# Altium schematic sheet Power_MPU.SchDoc: Power_MPU
size A3; CompanyName: STMicroelectronics; DocumentNumber: MB1272; Revision: A-01; SheetNumber: 4; SheetTotal: 15; Project: STM32MP15-DISCO PI
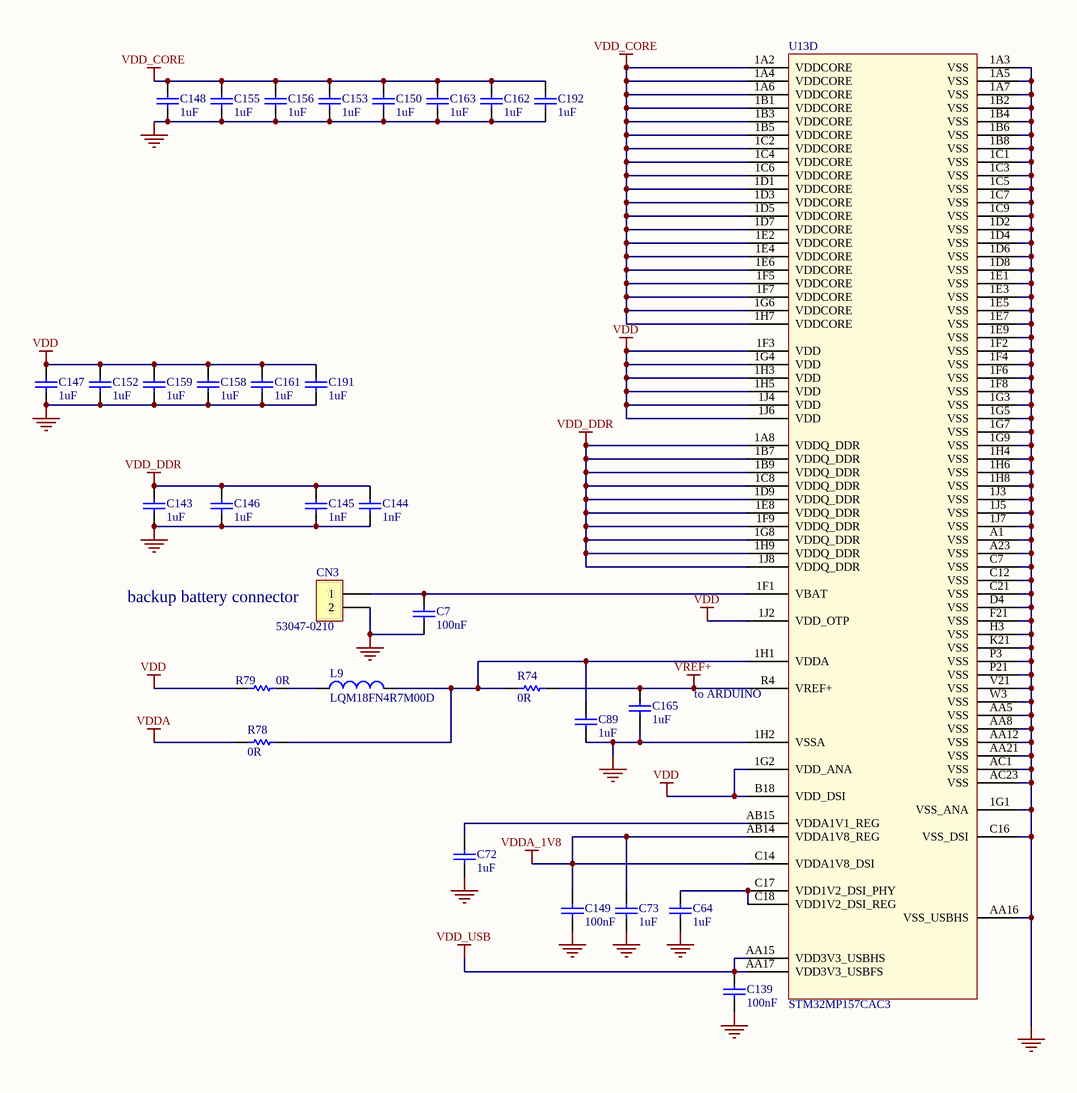
[diagram p0: Power_MPU.SchDoc]

## Parts
C7  value 100nF  [C0402]
C64  value 1uF  [C0402]
C72  value 1uF  [C0402]
C73  value 1uF  [C0402]
C89  value 1uF  [C0402]
C139  value 100nF  [C0402]
C143  value 1uF  [C0402]
C144  value 1nF  [C0402]
C145  value 1nF  [C0402]
C146  value 1uF  [C0402]
C147  value 1uF  [C0402]
C148  value 1uF  [C0402]
C149  value 100nF  [C0402]
C150  value 1uF  [C0402]
C152  value 1uF  [C0402]
C153  value 1uF  [C0402]
C155  value 1uF  [C0402]
C156  value 1uF  [C0402]
C158  value 1uF  [C0402]
C159  value 1uF  [C0402]
C161  value 1uF  [C0402]
C162  value 1uF  [C0402]
C163  value 1uF  [C0402]
C165  value 1uF  [C0402]
C191  value 1uF  [C0402]
C192  value 1uF  [C0402]
CN3  value 53047-0210  [CON_MOLEX_53047-0210]
L9  LQM18FN4R7M00D  [L0603]
R74  value 0R  [R0402]
R78  value 0R  [R0402]
R79  value 0R  [R0402]
U13  STM32MP157CAC3  [ICC_TFBGA361_12X12_STM32MP157CAC3_P050-065]  (part D of 5)

## Nets
GND: C7.1 C64.1 C72.1 C73.1 C89.1 C139.1 C143.1 C144.1 C145.1 C146.1 C147.1 C148.1 C149.1 C150.1 C152.1 C153.1 C155.1 C156.1 C158.1 C159.1 C161.1 C162.1 C163.1 C165.1 C191.1 C192.1 CN3.2 U13.1A3(VSS) U13.1A5(VSS) U13.1A7(VSS) U13.1B2(VSS) U13.1B4(VSS) U13.1B6(VSS) U13.1B8(VSS) U13.1C1(VSS) U13.1C3(VSS) U13.1C5(VSS) U13.1C7(VSS) U13.1C9(VSS) U13.1D2(VSS) U13.1D4(VSS) U13.1D6(VSS) U13.1D8(VSS) U13.1E1(VSS) U13.1E3(VSS) U13.1E5(VSS) U13.1E7(VSS) U13.1E9(VSS) U13.1F2(VSS) U13.1F4(VSS) U13.1F6(VSS) U13.1F8(VSS) U13.1G1(VSS_ANA) U13.1G3(VSS) U13.1G5(VSS) U13.1G7(VSS) U13.1G9(VSS) U13.1H2(VSSA) U13.1H4(VSS) U13.1H6(VSS) U13.1H8(VSS) U13.1J3(VSS) U13.1J5(VSS) U13.1J7(VSS) U13.A1(VSS) U13.A23(VSS) U13.AA5(VSS) U13.AA8(VSS) U13.AA12(VSS) U13.AA16(VSS_USBHS) U13.AA21(VSS) U13.AC1(VSS) U13.AC23(VSS) U13.C7(VSS) U13.C12(VSS) U13.C16(VSS_DSI) U13.C21(VSS) U13.D4(VSS) U13.F21(VSS) U13.H3(VSS) U13.K21(VSS) U13.P3(VSS) U13.P21(VSS) U13.V21(VSS) U13.W3(VSS)
VDD: C147.2 C152.2 C158.2 C159.2 C161.2 C191.2 R79.1 U13.1F3(VDD) U13.1G2(VDD_ANA) U13.1G4(VDD) U13.1H3(VDD) U13.1H5(VDD) U13.1J2(VDD_OTP) U13.1J4(VDD) U13.1J6(VDD) U13.B18(VDD_DSI)
VDD_CORE: C148.2 C150.2 C153.2 C155.2 C156.2 C162.2 C163.2 C192.2 U13.1A2(VDDCORE) U13.1A4(VDDCORE) U13.1A6(VDDCORE) U13.1B1(VDDCORE) U13.1B3(VDDCORE) U13.1B5(VDDCORE) U13.1C2(VDDCORE) U13.1C4(VDDCORE) U13.1C6(VDDCORE) U13.1D1(VDDCORE) U13.1D3(VDDCORE) U13.1D5(VDDCORE) U13.1D7(VDDCORE) U13.1E2(VDDCORE) U13.1E4(VDDCORE) U13.1E6(VDDCORE) U13.1F5(VDDCORE) U13.1F7(VDDCORE) U13.1G6(VDDCORE) U13.1H7(VDDCORE)
VDD_DDR: C143.2 C144.2 C145.2 C146.2 U13.1A8(VDDQ_DDR) U13.1B7(VDDQ_DDR) U13.1B9(VDDQ_DDR) U13.1C8(VDDQ_DDR) U13.1D9(VDDQ_DDR) U13.1E8(VDDQ_DDR) U13.1F9(VDDQ_DDR) U13.1G8(VDDQ_DDR) U13.1H9(VDDQ_DDR) U13.1J8(VDDQ_DDR)
VDD_USB: C139.2 U13.AA15(VDD3V3_USBHS) U13.AA17(VDD3V3_USBFS)
VDDA: R78.1
VDDA_1V8: C73.2 C149.2 U13.AB14(VDDA1V8_REG) U13.C14(VDDA1V8_DSI)
VREF+: C165.2 R74.2 U13.R4(VREF+)
NetC7_2: C7.2 CN3.1 U13.1F1(VBAT)
NetC64_2: C64.2 U13.C17(VDD1V2_DSI_PHY) U13.C18(VDD1V2_DSI_REG)
NetC72_2: C72.2 U13.AB15(VDDA1V1_REG)
NetC89_2: C89.2 L9.2 R74.1 R78.2 U13.1H1(VDDA)
NetL9_1: L9.1 R79.2

## Notes on the sheet
- (near CN3) backup battery connector
- to ARDUINO
- Title:
- Project:
- Size:
- Revision:
- Variant:
- A3
- -
- Date:
- Reference:
- Sheet:
- of

## Library data of the parts
C7 C139 C149 = MCD-00006: Capacitor,100nF,16V,X7R,10%,0402; Manufacturer_Part_Number: CC0402KRX7R7BB104; Manufacturer: YAGEO; Alternate_Manufacturer: MURATA; Alternate_Manufacturer_Part_Number: GCM155R71C104KA55D; Provided_By: SUBCO; Initial_Board_Reference: MB1274; Internal_Part_Number: MCD-00006; ComponentLink1Description: Datasheet; ECCN_US: n/a; ECCN_EU: n/a; Status: Released; Part_Type: Capacitor; Package: C0402; ComponentLink1URL: http://tunmcdsvn.tun.st.com/Component_Datasheet_Library/Trunk/Capacitors/Yageo_Multilayer_Capacitor_X7R_series_100pF_to_22uF
C64 C72 C73 C89 C143 C146-C148 C150 C152 C153 C155 C156 C158 C159 C161-C163 C165 C191 C192 = MCD-00095: Capacitor,1uF,6V3,X5R,10%,0402; Manufacturer_Part_Number: GRM155R61E105KA12; Manufacturer: MURATA; Alternate_Manufacturer_Part_Number: GRM155R60J105KE19; ECCN_US: EAR99; ECCN_EU: NEC; Provided_By: SUBCO; Initial_Board_Reference: MB1262; Internal_Part_Number: MCD-00095; Status: Released; Part_Type: Capacitor; Package: C0402; ComponentLink1Description: Datasheet; ComponentLink1URL: http://tunmcdsvn.tun.st.com/Component_Datasheet_Library/Trunk/Capacitors/Murata_Capacitor_GR_series; Alternate_Manufacturer: MURATA
C144 C145 = MCD-00198: Capacitor,1nF,16V,X7R,10%,0402; Manufacturer_Part_Number: CC0402KRX7R7BB102; Manufacturer: YAGEO; Provided_By: SUBCO; Internal_Part_Number: MCD-00198; Status: Released; Part_Type: Capacitor; Package: C0402; ComponentLink1Description: Datasheet; ComponentLink1URL: http://tunmcdsvn.tun.st.com/Component_Datasheet_Library/Trunk/Capacitors/Yageo_Multilayer_Capacitor_X7R_series_100pF_to_22uF
CN3 = MCD-00655: Header 2 circuits, 1.25mm Pitch ,  Vertical, with Friction Lock; Part_Type: Connector; Manufacturer: MOLEX; Provided_By: SUBCO; Initial_Board_Reference: MB1272; Internal_Part_Number: MCD-00655; Status: Footprint available; Manufacturer_Part_Number: 53047-0210; ComponentLink1Description: Datasheet; ComponentLink1URL: http://tunmcdsvn.tun.st.com/Component_Datasheet_Library/Trunk/Connectors/Molex_SD530470210; ECCN_US: n/a; ECCN_EU: n/a
L9 = MCD-01134: IND 4.7µH 20% 80mA 600mhom 0603; Part_Type: Inductor; Manufacturer: MURATA; Provided_By: SUBCO; Initial_Board_Reference: MB1272; Internal_Part_Number: MCD-01134; Value: LQM18FN4R7M00D; Status: Footprint available; Manufacturer_Part_Number: LQM18FN4R7M00D; Package: 0603; ComponentLink1Description: Datasheet; ComponentLink1URL: http://tunmcdsvn.tun.st.com/Component_Datasheet_Library/Trunk/Inductors/Murata_inductor_LQM18FN4R7M00D; ECCN_US: n/a; ECCN_EU: n/a
R74 R78 = MCD-00052: Resistor,0R,0402,5%,1/16W; Manufacturer_Part_Number: RC0402JR-070RL; Manufacturer: YAGEO; Provided_By: SUBCO; Initial_Board_Reference: MB1274; Internal_Part_Number: MCD-00052; Status: Released; Part_Type: Resistor; ComponentLink1Description: Datasheet; ECCN_US: n/a; ECCN_EU: n/a; ComponentLink1URL: http://tunmcdsvn.tun.st.com/Component_Datasheet_Library/Trunk/Resistors/Yageo_Resistor_RC0402-series; Package: R0402
R79 = MCD-00052: Resistor,0R,0402,5%,1/16W; Manufacturer_Part_Number: RC0402JR-070RL; Manufacturer: YAGEO; Provided_By: SUBCO; Initial_Board_Reference: MB1274; Fitted: NO; Internal_Part_Number: MCD-00052; Status: Released; Part_Type: Resistor; ComponentLink1Description: Datasheet; ECCN_US: n/a; ECCN_EU: n/a; ComponentLink1URL: http://tunmcdsvn.tun.st.com/Component_Datasheet_Library/Trunk/Resistors/Yageo_Resistor_RC0402-series; Package: R0402
U13 = MCD-00677: MPU TFBGA12x12 secure boot+crypto; Part_Type: IC; Manufacturer: STMICROELECTRONICS; BMS_Part_Number: 9175503; Provided_By: SUBCO with ST control; Internal_Part_Number: MCD-00677; Value: STM32MP157CAC3; Status: Footprint available; Manufacturer_Part_Number: STM32MP157CAC3; ComponentLink1Description: Datasheet; ComponentLink1URL: http://tunmcdsvn.tun.st.com/Component_Datasheet_Library/Trunk/IC/STM_MPU_12x12_POA_DM00342580_POA12x12